# EAGLE design untitled (EAGLE 6.5.0)
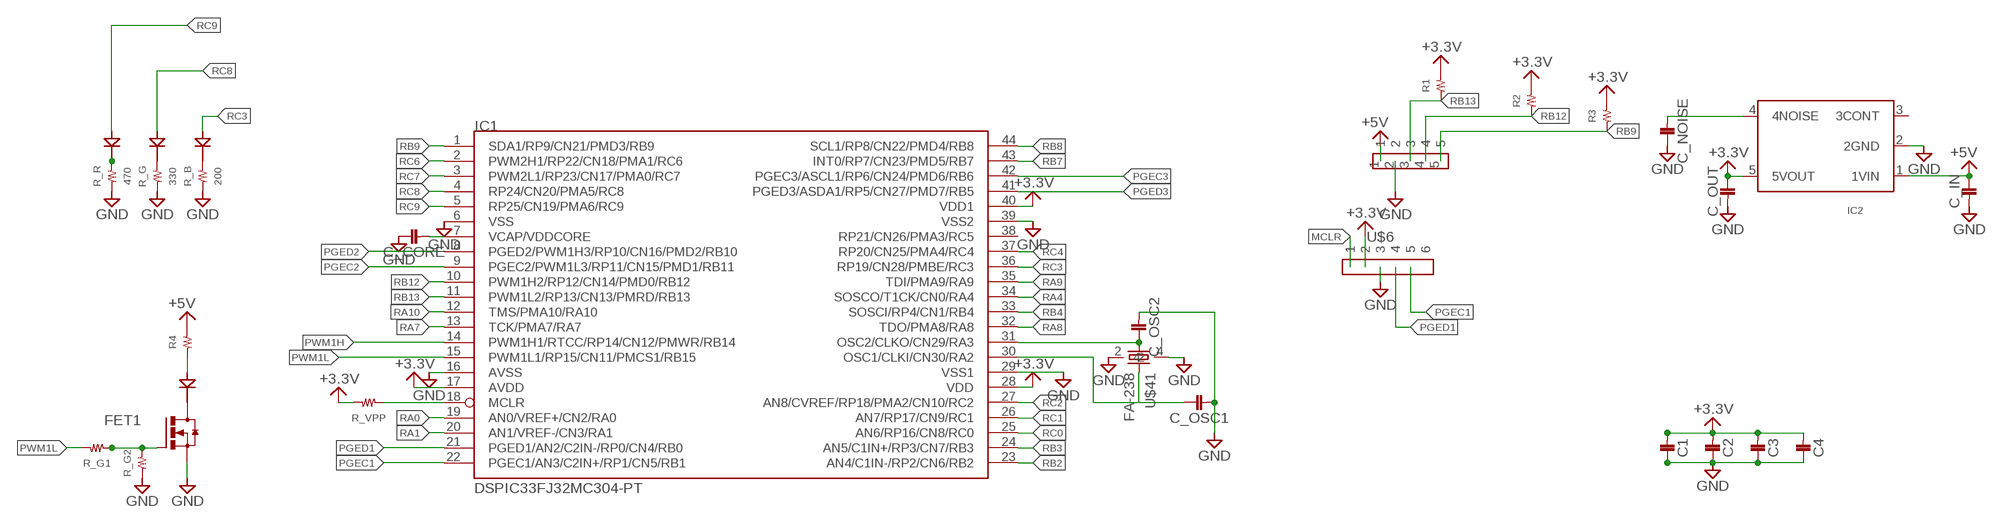
[diagram p0: schematic, sheet 1]

## Parts
B  CHIPLED  [1608]
C1  1608  [1608]
C2  1608  [1608]
C3  1608  [1608]
C4  1608  [1608]
C_CORE  2012  [2012]
C_IN  1608  [1608]
C_NOISE  1608  [1608]
C_OSC1  1608  [1608]
C_OSC2  1608  [1608]
C_OUT  1608  [1608]
FET1  ＩＲＬＭＬ６３４４  [SOT23]
G  CHIPLED  [1608]
IC1  DSPIC33FJ32MC304-PT  [TQFP44]
IC2  TAR5SB  [SSOP5-P-0.95]
IR  5MMLED  [5MM]
R  CHIPLED  [1608]
R1  RESISTOR__SMD  [1608]
R2  RESISTOR__SMD  [1608]
R3  RESISTOR__SMD  [1608]
R4  RESISTOR__SMD  [1608]
R_B  200  RESISTOR__SMD  [1608]
R_G  330  RESISTOR__SMD  [1608]
R_G1  RESISTOR__SMD  [1608]
R_G2  RESISTOR__SMD  [1608]
R_R  470  RESISTOR__SMD  [1608]
R_VPP  RESISTOR__SMD  [1608]
U$6  PIN_HEADER_6  [PIN_HEADER_6]
U$8  PIN_HEADER_5  [PIN_HEADER_5]
U$41  FA-238  [FA-238]

## Nets
+3.3V: C1.P$2 C2.P$2 C3.P$2 C4.P$2 C_OUT.P$1 IC1.17(AVDD) IC1.28(VDD) IC1.40(VDD1) IC2.5(5VOUT) R1.2 R2.2 R3.2 R_VPP.2 U$6.2
+5V: C_IN.P$1 IC2.1(1VIN) R4.2 U$8.1
GND: C1.P$1 C2.P$1 C3.P$1 C4.P$1 C_CORE.1 C_IN.P$2 C_NOISE.P$1 C_OSC1.P$2 C_OSC2.P$2 C_OUT.P$2 FET1.2(S) IC1.6(VSS) IC1.16(AVSS) IC1.29(VSS1) IC1.39(VSS2) IC2.2(2GND) R_B.1 R_G2.1 R_G.1 R_R.1 U$6.3 U$8.2 U$41.2 U$41.4
IC2: C_NOISE.P$2 IC2.4(4NOISE)
MCLR: IC1.18(MCLR) R_VPP.1 U$6.1
N$1: FET1.3(D) IR.K
N$2: R.2(K) R_R.2
N$3: G.2(K) R_G.2
N$4: B.2(K) R_B.2
N$5: IR.A R4.1
N$9: C_OSC2.P$1 IC1.31(OSC2/CLKO/CN29/RA3) U$41.1
N$10: FET1.1(G) R_G1.1 R_G2.2
N$11: C_OSC1.P$1 IC1.30(OSC1/CLKI/CN30/RA2) U$41.3
PGEC1: IC1.22(PGEC1/AN3/C2IN+/RP1/CN5/RB1) U$6.5
PGEC2: IC1.9(PGEC2/PWM1L3/RP11/CN15/PMD1/RB11)
PGEC3: IC1.42(PGEC3/ASCL1/RP6/CN24/PMD6/RB6)
PGED1: IC1.21(PGED1/AN2/C2IN-/RP0/CN4/RB0) U$6.4
PGED2: IC1.8(PGED2/PWM1H3/RP10/CN16/PMD2/RB10)
PGED3: IC1.41(PGED3/ASDA1/RP5/CN27/PMD7/RB5)
PWM1H: IC1.14(PWM1H1/RTCC/RP14/CN12/PMWR/RB14)
PWM1L: IC1.15(PWM1L1/RP15/CN11/PMCS1/RB15) R_G1.2
RA0: IC1.19(AN0/VREF+/CN2/RA0)
RA1: IC1.20(AN1/VREF-/CN3/RA1)
RA4: IC1.34(SOSCO/T1CK/CN0/RA4)
RA7: IC1.13(TCK/PMA7/RA7)
RA8: IC1.32(TDO/PMA8/RA8)
RA9: IC1.35(TDI/PMA9/RA9)
RA10: IC1.12(TMS/PMA10/RA10)
RB2: IC1.23(AN4/C1IN-/RP2/CN6/RB2)
RB3: IC1.24(AN5/C1IN+/RP3/CN7/RB3)
RB4: IC1.33(SOSCI/RP4/CN1/RB4)
RB7: IC1.43(INT0/RP7/CN23/PMD5/RB7)
RB8: IC1.44(SCL1/RP8/CN22/PMD4/RB8)
RB9: IC1.1(SDA1/RP9/CN21/PMD3/RB9) R3.1 U$8.5
RB12: IC1.10(PWM1H2/RP12/CN14/PMD0/RB12) R2.1 U$8.4
RB13: IC1.11(PWM1L2/RP13/CN13/PMRD/RB13) R1.1 U$8.3
RC0: IC1.25(AN6/RP16/CN8/RC0)
RC1: IC1.26(AN7/RP17/CN9/RC1)
RC2: IC1.27(AN8/CVREF/RP18/PMA2/CN10/RC2)
RC3: B.1(A) IC1.36(RP19/CN28/PMBE/RC3)
RC4: IC1.37(RP20/CN25/PMA4/RC4)
RC6: IC1.2(PWM2H1/RP22/CN18/PMA1/RC6)
RC7: IC1.3(PWM2L1/RP23/CN17/PMA0/RC7)
RC8: G.1(A) IC1.4(RP24/CN20/PMA5/RC8)
RC9: IC1.5(RP25/CN19/PMA6/RC9) R.1(A)
VCAP/VDDCORE: C_CORE.2 IC1.7(VCAP/VDDCORE)
Unconnected: IC1.38(RP21/CN26/PMA3/RC5) IC2.3(3CONT) U$6.6

## Library data of the parts
B G R = 10_LED:CHIPLED
C1-C4 C_IN C_NOISE C_OSC1 C_OSC2 C_OUT = 02_C:1608
C_CORE = 02_C:2012
FET1 = 06_FET:ＩＲＬＭＬ６３４４
IC1 = microchip-dspic33fjxxmc (1):DSPIC33FJ32MC304: dsPIC33FJ32MC302/304, dsPIC33FJ64MCX02/X04, AND dsPIC33FJ128MCX02/X04 High-Performance, 16-bit Digital Signal Controllers Operating Range: * Up to 40 MIPS operation (at 3.0V -3.6V): - Industrial temperature range (-40°C to +85°C) - Extended temperature range (-40°C to +125°C) High-Performance DSC CPU: * Modified Harvard architecture * C compiler optimized instruction set * 16-bit wide data path * 24-bit wide instructions * Linear program memory addressing up to 4M instruction words * Linear data memory addressing up to 64 Kbytes * 83 base instructions: mostly 1 word/1 cycle * Two 40-bit accumulators with rounding and saturation options * Flexible and powerful addressing modes: - Indirect - Modulo - Bit-Reversed * Software stack * 16 x 16 fractional/integer multiply operations * 32/16 and 16/16 divide operations * Single-cycle multiply and accumulate: - Accumulator write back for DSP operations - Dual data fetch * Up to ±16-bit shifts for up to 40-bit data Direct Memory Access (DMA): * 8-channel hardware DMA * Up to 2 Kbytes dual ported DMA buffer area (DMA RAM) to store data transferred via DMA: - Allows data transfer between RAM and a peripheral while CPU is executing code (no cycle stealing) * Most peripherals support DMA Timers/Capture/Compare/PWM: * Timer/Counters, up to five 16-bit timers: - Can pair up to make two 32-bit timers - One timer runs as a Real-Time Clock with an external 32.768 kHz oscillator - Programmable prescaler * Input Capture (up to four channels): - Capture on up, down or both edges - 16-bit capture input functions - 4-deep FIFO on each capture * Output Compare (up to four channels): - Single or Dual 16-bit Compare mode - 16-bit Glitchless PWM mode * Hardware Real-Time Clock/Calendar (RTCC): - Provides clock, calendar, and alarm functions Interrupt Controller: * 5-cycle latency * Up to 53 available interrupt sources * Up to three external interrupts * Seven programmable priority levels * Five processor exceptions Digital I/O: * Peripheral pin Select functionality * Up to 35 programmable digital I/O pins * Wake-up/Interrupt-on-Change for up to 31 pins * Output pins can drive from 3.0V to 3.6V * Up to 5V output with open drain configuration * All digital input pins are 5V tolerant * 4 mA sink on all I/O pins On-Chip Flash and SRAM: * Flash program memory (up to 128 Kbytes) * Data SRAM (up to 16 Kbytes) * Boot, Secure, and General Security for program Flash System Management: * Flexible clock options: - External, crystal, resonator, internal RC - Fully integrated Phase-Locked Loop (PLL) - Extremely low jitter PLL * Power-up Timer * Oscillator Start-up Timer/Stabilizer * Watchdog Timer with its own RC oscillator * Fail-Safe Clock Monitor * Reset by multiple sources Power Management: * On-chip 2.5V voltage regulator * Switch between clock sources in real time * Idle, Sleep, and Doze modes with fast wake-up Analog-to-Digital Converters (ADCs): * 10-bit, 1.1 Msps or 12-bit, 500 Ksps conversion: - Two and four simultaneous samples (10-bit ADC) - Up to nine input channels with auto-scanning - Conversion start can be manual or synchronized with one of four trigger sources - Conversion possible in Sleep mode - ±2 LSb max integral nonlinearity - ±1 LSb max differential nonlinearity Audio Digital-to-Analog Converter (DAC): - 16-bit Dual Channel DAC module - 100 Ksps maximum sampling rate - Second-Order Digital Delta-Sigma Modulator Comparator Module: * Two analog comparators with programmable input/output configuration CMOS Flash Technology: * Low-power, high-speed Flash technology * Fully static design * 3.3V (±10%) operating voltage * Industrial and Extended temperature * Low power consumption Motor Control Peripherals: * 6-channel 16-bit Motor Control PWM: - Three duty cycle generators - Independent or Complementary mode - Programmable dead-time and output polarity - Edge-aligned or center-aligned - Manual output override control - One Fault input - Trigger for ADC conversions - PWM frequency for 16-bit resolution (@ 40 MIPS) = 1220 Hz for Edge-Aligned mode, 610 Hz for Center-Aligned mode - PWM frequency for 11-bit resolution (@ 40 MIPS) = 39.1 kHz for Edge-Aligned mode, 19.55 kHz for Center-Aligned mode * 2-channel 16-bit Motor Control PWM: - One duty cycle generator - Independent or Complementary mode - Programmable dead time and output polarity - Edge-aligned or center-aligned - Manual output override control - One Fault input - Trigger for ADC conversions - PWM frequency for 16-bit resolution (@ 40 MIPS) = 1220 Hz for Edge-Aligned mode, 610 Hz for Center-Aligned mode - PWM frequency for 11-bit resolution (@ 40 MIPS) = 39.1 kHz for Edge-Aligned mode, 19.55 kHz for Center-Aligned mode * 2-Quadrature Encoder Interface module: - Phase A, Phase B, and index pulse input - 16-bit up/down position counter - Count direction status - Position Measurement (x2 and x4) mode - Programmable digital noise filters on inputs - Alternate 16-bit Timer/Counter mode - Interrupt on position counter rollover/underflow
IC2 = 04_IC:TAR5SB
IR = 10_LED:5MMLED
R1-R4 R_B R_G R_G1 R_G2 R_R R_VPP = 01_R:RESISTOR__SMD
U$6 = 08_CONECTOR:PIN_HEADER_6
U$8 = 08_CONECTOR:PIN_HEADER_5
U$41 = 09_2_CRYSTAL:FA-238

## Board
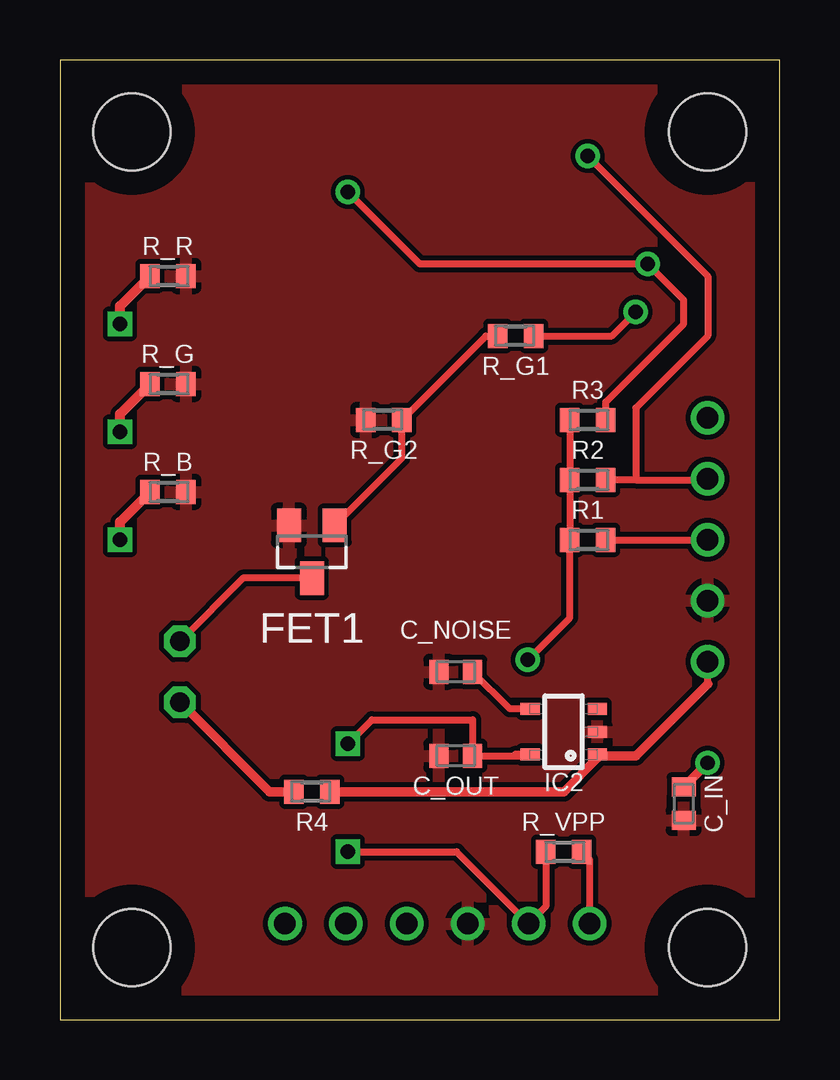
[diagram p1: board, top side]
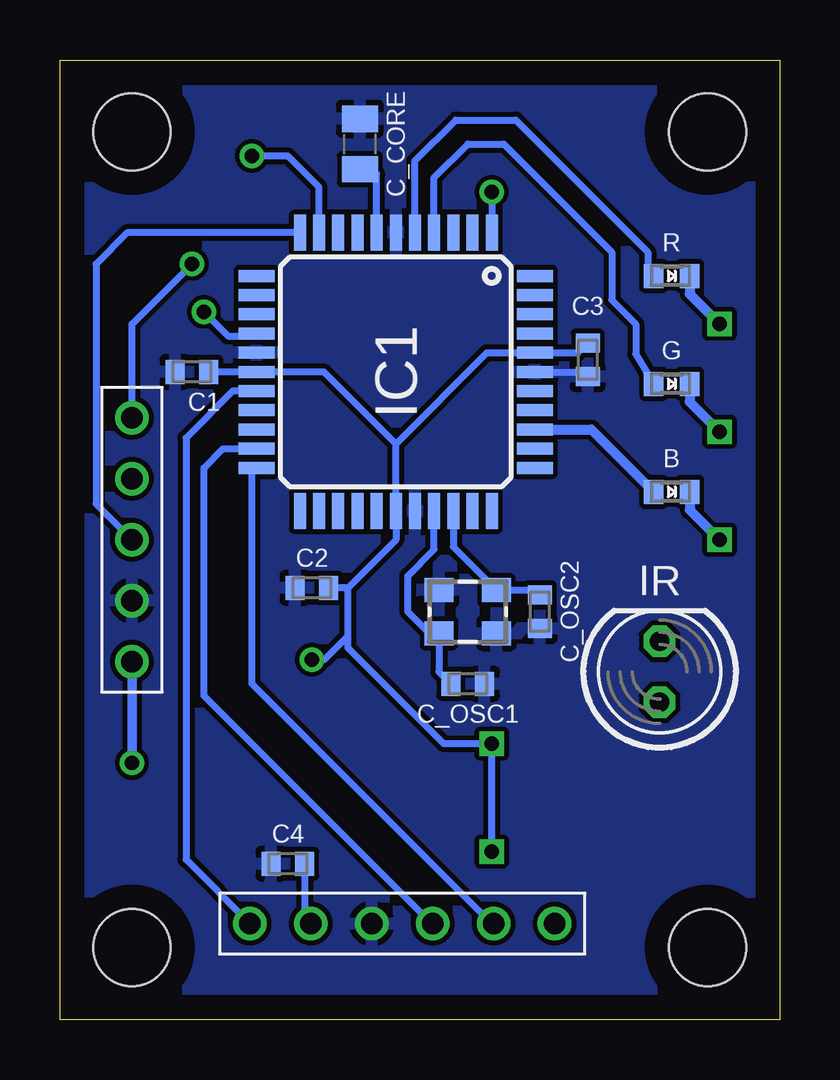
[diagram p2: board, bottom side, seen from below]

Size 30 x 40 mm. Coordinates in mm from the lower left corner, seen from the top.
Outline: 0,0 30,0 30,40 0,40 0,0
Copper layers (1*16): Top 0.035mm / dielectric 1.5mm / Bottom 0.035mm
Design rules "default *": minimum track width 10mil, minimum drill 0.6mm, track to track 8mil, track to pad 8mil, pad to pad 8mil, via to via 8mil, smd to smd 8mil, copper to edge 40mil, drill to drill 8mil, minimum pad ring 10mil, minimum via ring 8mil, stop-mask expansion 4mil, vias tented up to drill 0mil, thermal gap 10mil
Holes 3.2 mm at 3,3 3,37 27,37 27,3

### Footprints (pad centres in the part's own frame; a part is rotated, then mirrored left to right if it is on the bottom)
1608 = smd 0.8 x 1: 1 -0.75,0; 2 0.75,0
1608' = smd 0.8 x 1: P$1 -0.7,0; P$2 0.7,0
2012 = smd 1.1 x 1.5: 1 -1.05,0; 2 1.05,0
SOT23 = smd 1 x 1.4: 1 -0.95,-1.1; 2 0.95,-1.1; 3 0,1.1
TQFP44 = smd 1.5 x 0.5: 1 -5.8,4; 2 -5.8,3.2; 3 -5.8,2.4; 4 -5.8,1.6; 5 -5.8,0.8; 6 -5.8,0; 7 -5.8,-0.8; 8 -5.8,-1.6; 9 -5.8,-2.4; 10 -5.8,-3.2; 11 -5.8,-4; 23 5.8,-4; 24 5.8,-3.2; 25 5.8,-2.4; 26 5.8,-1.6; 27 5.8,-0.8; 28 5.8,0; 29 5.8,0.8; 30 5.8,1.6; 31 5.8,2.4; 32 5.8,3.2; 33 5.8,4 | smd 0.5 x 1.5: 12 -4,-5.8; 13 -3.2,-5.8; 14 -2.4,-5.8; 15 -1.6,-5.8; 16 -0.8,-5.8; 17 0,-5.8; 18 0.8,-5.8; 19 1.6,-5.8; 20 2.4,-5.8; 21 3.2,-5.8; 22 4,-5.8; 34 4,5.8; 35 3.2,5.8; 36 2.4,5.8; 37 1.6,5.8; 38 0.8,5.8; 39 0,5.8; 40 -0.8,5.8; 41 -1.6,5.8; 42 -2.4,5.8; 43 -3.2,5.8; 44 -4,5.8
SSOP5-P-0.95 = smd 0.5 x 0.8: 1 -0.95,-1.4; 2 0,-1.4; 3 0.95,-1.4; 4 0.95,1.4; 5 -0.95,1.4
5MM = drill 0.813 octagon: A 0,-1.27; K 0,1.27
PIN_HEADER_6 = drill 0.9: 1 -5.08,0; 2 -2.54,0; 3 0,0; 4 2.54,0; 5 5.08,0; 6 7.62,0
PIN_HEADER_5 = drill 0.9: 1 -5.08,0; 2 -2.54,0; 3 0,0; 4 2.54,0; 5 5.08,0
FA-238 = smd 1.2 x 1: 1 -1.2,-0.9; 2 1.2,-0.9; 3 1.2,0.9; 4 -1.2,0.9

### Placement (x,y rotation side)
B  4.5,22 0 bottom
C1  [1608']  24.5,27 0 bottom
C2  [1608']  19.5,18 0 bottom
C3  [1608']  8,27.5 90 bottom
C4  [1608']  20.5,6.5 0 bottom
C_CORE  17.5,36.5 270 bottom
C_IN  [1608']  26,9 270 top
C_NOISE  [1608']  16.5,14.5 0 top
C_OSC1  [1608']  13,14 0 bottom
C_OSC2  [1608']  10,17 270 bottom
C_OUT  [1608']  16.5,11 180 top
FET1  10.5,19.5 180 top
G  4.5,26.5 0 bottom
IC1  16,27 270 bottom
IC2  21,12 90 top
IR  5,14.5 0 bottom
R  4.5,31 0 bottom
R1  22,20 180 top
R2  22,22.5 180 top
R3  22,25 180 top
R4  10.5,9.5 0 top
R_B  4.5,22 180 top
R_G  4.5,26.5 180 top
R_G1  19,28.5 0 top
R_G2  13.5,25 0 top
R_R  4.5,31 180 top
R_VPP  21,7 180 top
U$6  17,4 0 bottom
U$8  27,20 90 bottom
U$41  13,17 180 bottom

### Tracks (layer width: path | path; a pad name or v marks a point on that pad's centre or on a via)
+3.3V  (via drill 0.6)
  Top 0.3: 18.95,11.05 IC2.5 19.55,11 C_OUT.P$1 17.2,12.5 13,12.5 v12,11.5 | v19.5,15 21.25,16.75 R1.2 R2.2 R3.2 | v12,7 16.54,7 U$6.2 20.25,4.71 R_VPP.2
  Bottom 0.3: C3.P$2 8.4,27.8 IC1.40 12.2,27.8 16,24 | 16,24 IC1.28 16,20 18,18 | C1.P$2 IC1.17 19,27 16,24 | 18,18 C2.P$2 19,17.8 | 18,16 18,15.5 14,11.5 v12,11.5 v12,7 | 18,16 18,18 | v19.5,15 19,15 18,16 | C4.P$2 19.8,4.26 U$6.2
+5V  (via drill 0.6)
  Top 0.3: 27,14 U$8.1
  Top 0.4: R4.2 21,9.5 22.4,10.9 | 22.4,10.9 IC2.1 | C_IN.P$1 v27,10.7 | 22.4,10.9 22.5,11 24,11 27,14
  Bottom 0.4: v27,10.7 U$8.1
GND
  Bottom 0.3: IC1.39 8.2,27 C3.P$1
  pour Bottom: 0,40 30,40 30,0 0,0
  pour Top (isolate 0.1): 0,40 30,40 30,0 0,0
IC2
  Top 0.3: IC2.4 18.75,12.95 C_NOISE.P$2
MCLR
  Top 0.3: R_VPP.1 22.08,6.67 U$6.1
  Bottom 0.3: IC1.18 22.8,26.2 24.75,24.25 24.75,6.67 U$6.1
N$1
  Top 0.3: FET1.3 7.63,18.4 IR.K
N$2  (via drill 0.6)
  Top 0.406: v2.5,29 2.5,29.75 R.2
  Bottom 0.406: R.2 3.75,30.25 v2.5,29
N$3  (via drill 0.6)
  Top 0.406: v2.5,24.5 2.5,25.25 G.2
  Bottom 0.406: G.2 3.75,25.75 v2.5,24.5
N$4  (via drill 0.6)
  Top 0.406: v2.5,20 2.5,20.75 B.2
  Bottom 0.406: B.2 3.75,21.25 v2.5,20
N$5
  Top 0.4: IR.A 8.73,9.5 R4.1
N$9
  Bottom 0.3: IC1.31 13.6,19.7 U$41.1 10.2,17.9 C_OSC2.P$1
N$10
  Top 0.3: FET1.1 14.25,23.4 R_G2.2 17.75,28.5 R_G1.1
N$11
  Bottom 0.3: C_OSC1.P$1 14.2,14.5 U$41.3 14.6,16.1 15.5,17 15.5,18.5 14.4,19.6 IC1.30
PGEC1
  Bottom 0.3: U$6.5 12,4 22,14 22,22.8 IC1.22
PGED1
  Bottom 0.3: U$6.4 14.5,4 24,13.5 24,23 23.2,23.8 IC1.21
PWM1L  (via drill 0.6)
  Top 0.3: R_G1.2 23,28.5 v24,29.5
  Bottom 0.3: v24,29.5 23,28.5 21.9,28.5 IC1.15
RB9  (via drill 0.6)
  Top 0.3: v12,34.5 15,31.5 v24.5,31.5 26,30 26,29 22.75,25.75 R3.1
  Bottom 0.3: U$8.5 27,29 v24.5,31.5 | v12,34.5 IC1.1
RB12  (via drill 0.6)
  Top 0.3: 24,22.5 R2.1 | v22,36 27,31 27,28.5 24,25.5 24,22.5 | 24,22.5 26.96,22.5 U$8.4
  Bottom 0.3: IC1.10 19.2,34.7 20.5,36 v22,36
RB13
  Top 0.3: R1.1 U$8.3
  Bottom 0.3: IC1.11 27.2,32.8 28.5,31.5 28.5,21.5 U$8.3
RC3
  Bottom 0.406: IC1.36 7.85,24.6 B.1
RC8
  Bottom 0.3: IC1.4 14.4,35.1 13,36.5 11.5,36.5 7,32 7,30 6,29 6,27.75 G.1
RC9
  Bottom 0.3: IC1.5 15.2,35.8 13.5,37.5 11,37.5 5.5,32 5.5,31.25 R.1
VCAP/VDDCORE
  Bottom 0.3: IC1.7 16.8,35.25 C_CORE.2